# Altium schematic sheet Ornament.SchDoc
size C; SheetNumber: 1; SheetTotal: 1; ENG_APP_DATE: --/--/--; DSN_APP_DATE: --/--/--; CHK_APP_DATE: --/--/--; SchematicPartNumber: 1XPXXXX
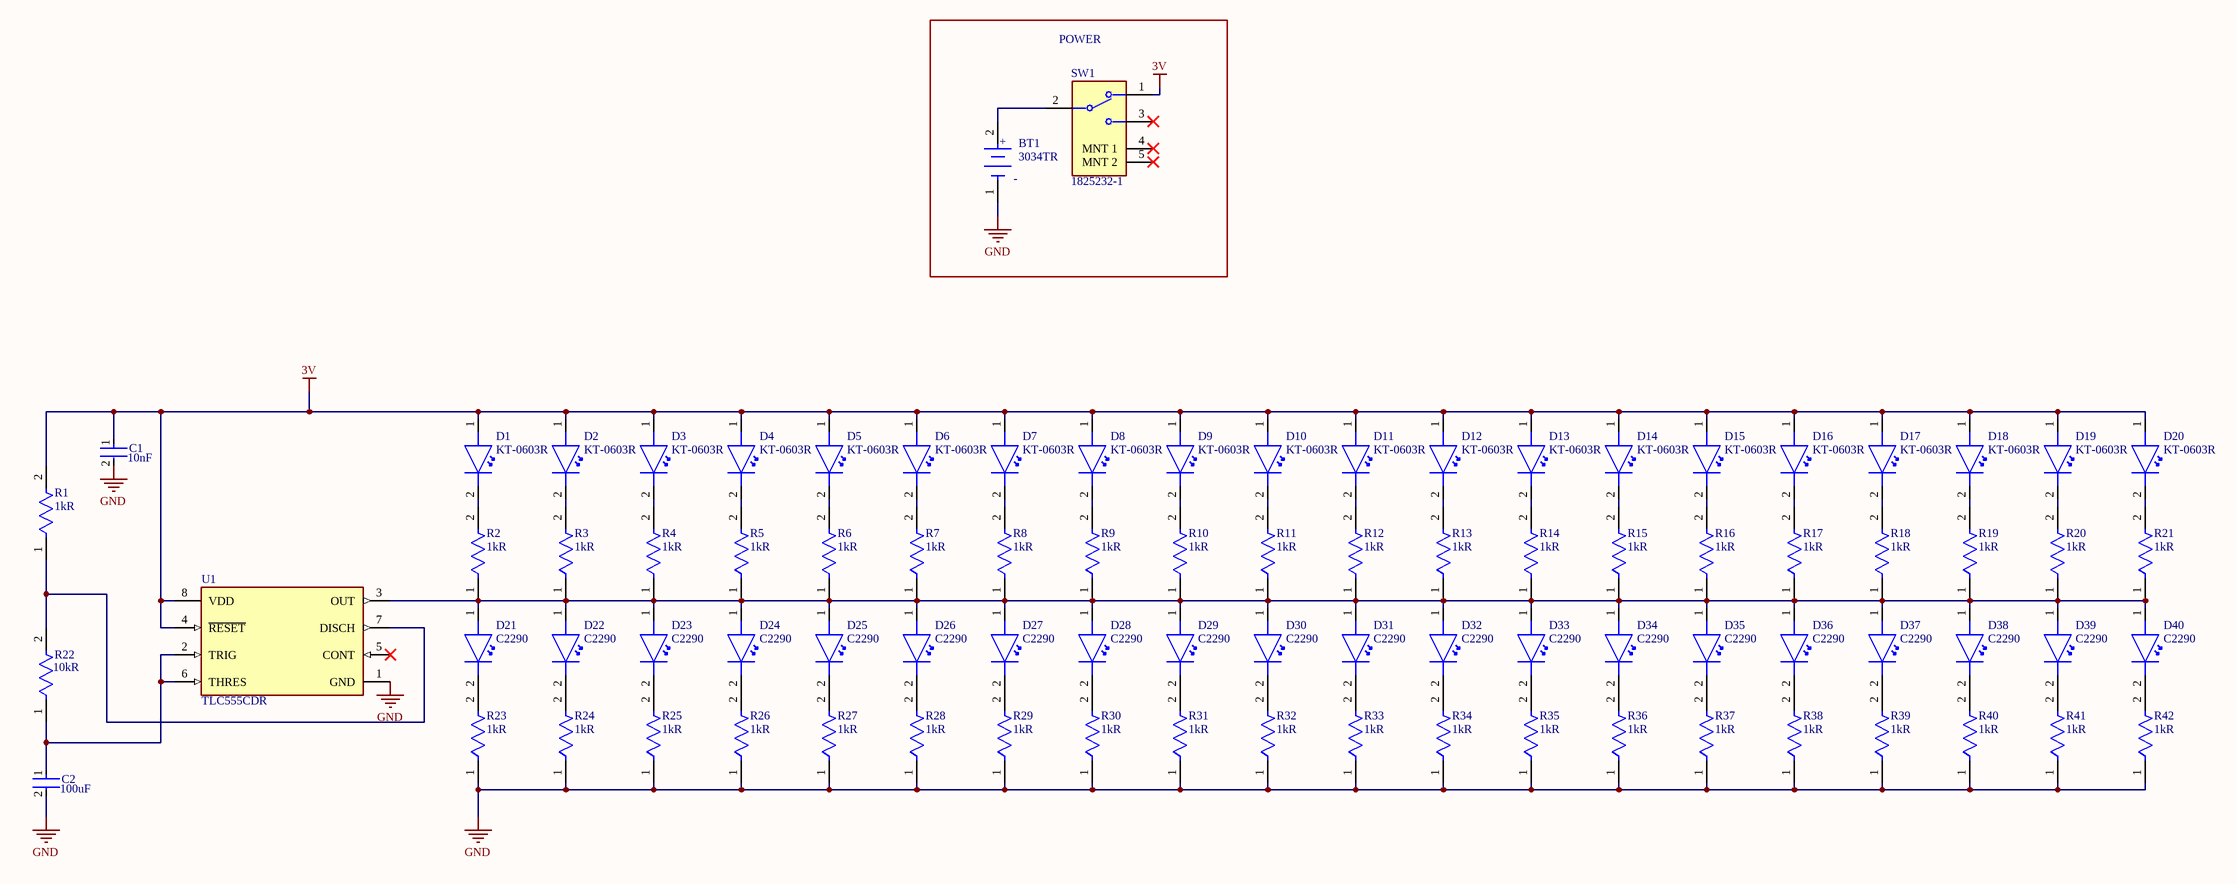
[diagram p0: Ornament.SchDoc]

## Parts
BT1  3034TR  [FP-3034TR-MFG]
C1  Capacitance: 10nF  [FP-CL165-IPC_C]  (hidden comment: CL05B103KB5NNNC)
C2  Capacitance: 100uF  [FP-MK316L-MFG]  (hidden comment: JMK316BJ107ML-T)
D1  KT-0603R  [LED_0603]
D2  KT-0603R  [LED_0603]
D3  KT-0603R  [LED_0603]
D4  KT-0603R  [LED_0603]
D5  KT-0603R  [LED_0603]
D6  KT-0603R  [LED_0603]
D7  KT-0603R  [LED_0603]
D8  KT-0603R  [LED_0603]
D9  KT-0603R  [LED_0603]
D10  KT-0603R  [LED_0603]
D11  KT-0603R  [LED_0603]
D12  KT-0603R  [LED_0603]
D13  KT-0603R  [LED_0603]
D14  KT-0603R  [LED_0603]
D15  KT-0603R  [LED_0603]
D16  KT-0603R  [LED_0603]
D17  KT-0603R  [LED_0603]
D18  KT-0603R  [LED_0603]
D19  KT-0603R  [LED_0603]
D20  KT-0603R  [LED_0603]
D21  C2290  [LED_0603]
D22  C2290  [LED_0603]
D23  C2290  [LED_0603]
D24  C2290  [LED_0603]
D25  C2290  [LED_0603]
D26  C2290  [LED_0603]
D27  C2290  [LED_0603]
D28  C2290  [LED_0603]
D29  C2290  [LED_0603]
D30  C2290  [LED_0603]
D31  C2290  [LED_0603]
D32  C2290  [LED_0603]
D33  C2290  [LED_0603]
D34  C2290  [LED_0603]
D35  C2290  [LED_0603]
D36  C2290  [LED_0603]
D37  C2290  [LED_0603]
D38  C2290  [LED_0603]
D39  C2290  [LED_0603]
D40  C2290  [LED_0603]
R1  Resistance: 1kR  [FP-AC0402-IPC_C]  (hidden comment: AC0402FR-071KL)
R2  Resistance: 1kR  [FP-AC0402-IPC_C]  (hidden comment: AC0402FR-071KL)
R3  Resistance: 1kR  [FP-AC0402-IPC_C]  (hidden comment: AC0402FR-071KL)
R4  Resistance: 1kR  [FP-AC0402-IPC_C]  (hidden comment: AC0402FR-071KL)
R5  Resistance: 1kR  [FP-AC0402-IPC_C]  (hidden comment: AC0402FR-071KL)
R6  Resistance: 1kR  [FP-AC0402-IPC_C]  (hidden comment: AC0402FR-071KL)
R7  Resistance: 1kR  [FP-AC0402-IPC_C]  (hidden comment: AC0402FR-071KL)
R8  Resistance: 1kR  [FP-AC0402-IPC_C]  (hidden comment: AC0402FR-071KL)
R9  Resistance: 1kR  [FP-AC0402-IPC_C]  (hidden comment: AC0402FR-071KL)
R10  Resistance: 1kR  [FP-AC0402-IPC_C]  (hidden comment: AC0402FR-071KL)
R11  Resistance: 1kR  [FP-AC0402-IPC_C]  (hidden comment: AC0402FR-071KL)
R12  Resistance: 1kR  [FP-AC0402-IPC_C]  (hidden comment: AC0402FR-071KL)
R13  Resistance: 1kR  [FP-AC0402-IPC_C]  (hidden comment: AC0402FR-071KL)
R14  Resistance: 1kR  [FP-AC0402-IPC_C]  (hidden comment: AC0402FR-071KL)
R15  Resistance: 1kR  [FP-AC0402-IPC_C]  (hidden comment: AC0402FR-071KL)
R16  Resistance: 1kR  [FP-AC0402-IPC_C]  (hidden comment: AC0402FR-071KL)
R17  Resistance: 1kR  [FP-AC0402-IPC_C]  (hidden comment: AC0402FR-071KL)
R18  Resistance: 1kR  [FP-AC0402-IPC_C]  (hidden comment: AC0402FR-071KL)
R19  Resistance: 1kR  [FP-AC0402-IPC_C]  (hidden comment: AC0402FR-071KL)
R20  Resistance: 1kR  [FP-AC0402-IPC_C]  (hidden comment: AC0402FR-071KL)
R21  Resistance: 1kR  [FP-AC0402-IPC_C]  (hidden comment: AC0402FR-071KL)
R22  Resistance: 10kR  [FP-AC0402-MFG]  (hidden comment: AC0402FR-0710KL)
R23  Resistance: 1kR  [FP-AC0402-IPC_C]  (hidden comment: AC0402FR-071KL)
R24  Resistance: 1kR  [FP-AC0402-IPC_C]  (hidden comment: AC0402FR-071KL)
R25  Resistance: 1kR  [FP-AC0402-IPC_C]  (hidden comment: AC0402FR-071KL)
R26  Resistance: 1kR  [FP-AC0402-IPC_C]  (hidden comment: AC0402FR-071KL)
R27  Resistance: 1kR  [FP-AC0402-IPC_C]  (hidden comment: AC0402FR-071KL)
R28  Resistance: 1kR  [FP-AC0402-IPC_C]  (hidden comment: AC0402FR-071KL)
R29  Resistance: 1kR  [FP-AC0402-IPC_C]  (hidden comment: AC0402FR-071KL)
R30  Resistance: 1kR  [FP-AC0402-IPC_C]  (hidden comment: AC0402FR-071KL)
R31  Resistance: 1kR  [FP-AC0402-IPC_C]  (hidden comment: AC0402FR-071KL)
R32  Resistance: 1kR  [FP-AC0402-IPC_C]  (hidden comment: AC0402FR-071KL)
R33  Resistance: 1kR  [FP-AC0402-IPC_C]  (hidden comment: AC0402FR-071KL)
R34  Resistance: 1kR  [FP-AC0402-IPC_C]  (hidden comment: AC0402FR-071KL)
R35  Resistance: 1kR  [FP-AC0402-IPC_C]  (hidden comment: AC0402FR-071KL)
R36  Resistance: 1kR  [FP-AC0402-IPC_C]  (hidden comment: AC0402FR-071KL)
R37  Resistance: 1kR  [FP-AC0402-IPC_C]  (hidden comment: AC0402FR-071KL)
R38  Resistance: 1kR  [FP-AC0402-IPC_C]  (hidden comment: AC0402FR-071KL)
R39  Resistance: 1kR  [FP-AC0402-IPC_C]  (hidden comment: AC0402FR-071KL)
R40  Resistance: 1kR  [FP-AC0402-IPC_C]  (hidden comment: AC0402FR-071KL)
R41  Resistance: 1kR  [FP-AC0402-IPC_C]  (hidden comment: AC0402FR-071KL)
R42  Resistance: 1kR  [FP-AC0402-IPC_C]  (hidden comment: AC0402FR-071KL)
SW1  1825232-1  [FP-1825232-1-MFG]
U1  TLC555CDR  [FP-D0008A-IPC_B]

## Blocks framed on the sheet
POWER: BT1 SW1

## Nets
3V: C1.1 D1.1 D2.1 D3.1 D4.1 D5.1 D6.1 D7.1 D8.1 D9.1 D10.1 D11.1 D12.1 D13.1 D14.1 D15.1 D16.1 D17.1 D18.1 D19.1 D20.1 R1.2 SW1.1 U1.4(~{RESET}) U1.8(VDD)
GND: BT1.1(C) C1.2 C2.2 R23.1 R24.1 R25.1 R26.1 R27.1 R28.1 R29.1 R30.1 R31.1 R32.1 R33.1 R34.1 R35.1 R36.1 R37.1 R38.1 R39.1 R40.1 R41.1 R42.1 U1.1(GND)
NetBT1_2: BT1.2(A) SW1.2
NetC2_1: C2.1 R22.1 U1.2(TRIG) U1.6(THRES)
NetD1_2: D1.2 R2.2
NetD2_2: D2.2 R3.2
NetD3_2: D3.2 R4.2
NetD4_2: D4.2 R5.2
NetD5_2: D5.2 R6.2
NetD6_2: D6.2 R7.2
NetD7_2: D7.2 R8.2
NetD8_2: D8.2 R9.2
NetD9_2: D9.2 R10.2
NetD10_2: D10.2 R11.2
NetD11_2: D11.2 R12.2
NetD12_2: D12.2 R13.2
NetD13_2: D13.2 R14.2
NetD14_2: D14.2 R15.2
NetD15_2: D15.2 R16.2
NetD16_2: D16.2 R17.2
NetD17_2: D17.2 R18.2
NetD18_2: D18.2 R19.2
NetD19_2: D19.2 R20.2
NetD20_2: D20.2 R21.2
NetD21_1: D21.1 D22.1 D23.1 D24.1 D25.1 D26.1 D27.1 D28.1 D29.1 D30.1 D31.1 D32.1 D33.1 D34.1 D35.1 D36.1 D37.1 D38.1 D39.1 D40.1 R2.1 R3.1 R4.1 R5.1 R6.1 R7.1 R8.1 R9.1 R10.1 R11.1 R12.1 R13.1 R14.1 R15.1 R16.1 R17.1 R18.1 R19.1 R20.1 R21.1 U1.3(OUT)
NetD21_2: D21.2 R23.2
NetD22_2: D22.2 R24.2
NetD23_2: D23.2 R25.2
NetD24_2: D24.2 R26.2
NetD25_2: D25.2 R27.2
NetD26_2: D26.2 R28.2
NetD27_2: D27.2 R29.2
NetD28_2: D28.2 R30.2
NetD29_2: D29.2 R31.2
NetD30_2: D30.2 R32.2
NetD31_2: D31.2 R33.2
NetD32_2: D32.2 R34.2
NetD33_2: D33.2 R35.2
NetD34_2: D34.2 R36.2
NetD35_2: D35.2 R37.2
NetD36_2: D36.2 R38.2
NetD37_2: D37.2 R39.2
NetD38_2: D38.2 R40.2
NetD39_2: D39.2 R41.2
NetD40_2: D40.2 R42.2
NetR1_1: R1.1 R22.2 U1.7(DISCH)

Not connected (* = marked no-connect by the designer): SW1 3* 4(MNT_1)* 5(MNT_2)*; U1 5(CONT)*

## Notes on the sheet
- CONFIDENTIAL
- DWG. NO.
- This drawing, including the information it bears, is the property of Fisher-Rosemount Systems Inc. (FRSI) and must be held in strict confidence and properly safeguarded by the recipient at all times. it may not be copied or reproduced, or provided or revealed to any other party, except with the prior written authorization of FRSI and
- any authorized copy or reproduction must inlcude this legend. The recipient may use the same only for the purpose for which FRSI has provided it to recipient, and it must be returned to FRSI, along with all ocpies and reproductions, upon request. By accpeting this drawing, the recipient agrees to the foregoing.
- TOLERANCES
- UNLESS OTHERWISE SPECIFIED
- .X
- .XX
- .XXX
- _
- c
- ALL RIGHTS RESERVED
- FISHER-ROSEMOUNT SYSTEMS INC.
- SCHEMATIC
- UNIT OF MEASURE
- R OR CHAM MAX
- REVISIONS
- DWN.
- CHKD.
- BY
- DATE
- DESIGN
- DWG NO.
- REV.
- DO NOT SCALE THIS DWG
- ANSI Y14.5
- SUPERSEDES
- Fisher-Rosemount Systems
- Round Rock,Texas, USA
- APVD.
- SCALE
- 1=1
- TOOL
- M
- SIZE
- C
- SHEET
- OF
- (in symbol CMP-19636-000007-1) +; -

## Library data of the parts
BT1 = CMP-19636-000007-1: BATTERY RETAINER COIN 20MM SMD; Number of Batteries: 1; Lead Free: Lead Free; Mount: Surface Mount; Number of Cells: 1; Termination: SMD/SMT; Package Quantity: 500; Packaging: Tape and Reel; Contact Plating: Tin; Case/Package: SMD/SMT; Material: Bronze
C1 = CMP-13271-000387-1: Cap Ceramic 10nF 50V X7R ±10% SMD 0402 +125°C Paper T/R; Depth: 0.5mm; Length: 1mm; Lead Free: Lead Free; Case Code (Metric): 1005; Width: 0.02inch; Min Operating Temperature: -55°C; Thickness: 0.022inch; Package Quantity: 1; Mount: Surface Mount; Height: 0.5mm; Voltage: 50V; Material: Ceramic; Tolerance: 10%; Case Code (Imperial): 0402; Radiation Hardening: No; Case/Package: 0402; Max Operating Temperature: 125°C; Voltage Rating (DC): 50V; Contact Plating: Tin; Packaging: Tape and Reel; Voltage Rating: 50V; Dielectric: X7R
C2 = CMP-2000-06499-2: CAP CER 100UF 6.3V X5R 1206; Tolerance: 2%; Depth: 1.6mm; Voltage Rating (DC): 6.3V; RoHS Compliant: Yes; Case Code (Metric): 3216; Thickness: 0.071inch; Package Quantity: 1; Max Operating Temperature: 85°C; Series: M; Mount: Surface Mount; Radiation Hardening: No; Termination: SMD/SMT; Voltage Rating: 6.3V; Width: 0.063inch; Packaging: Tape and Reel; Number of Pins: 2; Case/Package: 1206; Construction: Flat; Length: 3.2mm; Dielectric: X5R; Min Operating Temperature: -55°C; Height: 1.6mm; Case Code (Imperial): 1206; Lead Free: Lead Free
D1-D20 = KT-0603R: Red 615~630nm 1.9~2.2V 0603 Light Emitting Diodes (LED) RoHS
D21-D40 = C2290: White 0603 Light Emitting Diodes (LED) RoHS
R1-R21 R23-R42 = CMP-2002-01799-3: RES 1kΩ ±1% 0.063W 0402; Temperature Coefficient: 100ppm/°C; Power Rating: 62.5mW; Max Power Dissipation: 63mW; Voltage Rating: 50V; Height: 0.015inch; Size Code: 0402; Min Operating Temperature: -55°C; Number of Terminations: 2; Width: 0.02inch; RoHS Compliant: Yes; Termination: SMD/SMT; Construction: Rectangular; Tolerance: 1%; Military Standard: Not; Series: AC; Packaging: Tape and Reel; Depth: 0.5mm; Lead Free: Lead Free; Max Operating Temperature: 155°C; Case Code (Metric): 1005; Resistor Type: Thick Film; Features: Moisture Resistant; Case Code (Imperial): 0402; Package Quantity: 1; Case/Package: 0402; Length: 0.039inch
R22 = CMP-2002-01790-3: RES 10kΩ ±1% 0.063W 0402; Power Rating: 62.5mW; Voltage Rating: 50V; Temperature Coefficient: 100ppm/°C; Max Power Dissipation: 63mW; Tolerance: 1%; Military Standard: Not; Construction: Rectangular; Termination: SMD/SMT; Max Operating Temperature: 155°C; Min Operating Temperature: -55°C; Height: 0.015inch; Lead Free: Lead Free; Width: 0.02inch; Case/Package: 0402; Resistor Type: Thick Film; Series: AC; Features: Moisture Resistant; RoHS Compliant: Yes; Number of Terminations: 2; Case Code (Metric): 1005; Length: 0.039inch; Depth: 0.5mm; Size Code: 0402; Packaging: Tape and Reel; Case Code (Imperial): 0402
SW1 = CMP-03405-000001-1: SWITCH SLIDE SPDT 200MA 30V; Manufacturer: TE Connectivity; Contact Current Rating: 0.2A; Description: Switch Slide ON None ON SPDT Side Slide 0.2A 30VDC 10000Cycle PC Pins Bracket Mount/Through Hole; Contact Resistance: 20mΩ; Electromechanical Life: 10000Cycles; Operating Force: 200gf; Throw Configuration: SPDT; Manufacturer Part Number: 1825232-1; Temperature Range High: +70°C; Height: 3.7mm; ComponentLink2URL: https://www.te.com/commerce/DocumentDelivery/DDEController?Action=showdoc&DocId=Customer+Drawing%7F1825232%7FB2%7Fpdf%7FEnglish%7FENG_CD_1825232_B2.pdf%7F1825232-1; Mount: Through Hole; Mouser Description: Slide Switches SLIDE SWITCH SPDT Right Angle; Package: 1825232-1; Temperature: -20°C to +70°C; Automotive: No; ComponentLink2Description: Datasheet; Lead Free: Yes; Octopart: https://octopart.com/1825232-1-te+connectivity-45209882; Device Class L1: Electromechanical; Digikey Description: SWITCH SLIDE SPDT 200MA 30V; Device Class L3: Slide Switches; Device Class L2: Switches; Voltage Rating Dc: 30V; Temperature Range Low: -20°C; Category: Switch; RoHS: TRUE
U1 = CMP-04857-000001-1: IC OSC SGL TIMER 2.1MHZ 8-SOIC; Min Supply Voltage: 2V; Number of Channels: 1; Max Power Dissipation: 725mW; Max Supply Voltage: 15V; Low Level Output Current: 100mA; Current Rating: 250A; Quiescent Current: 250uA; Operating Supply Current: 360uA; High Level Output Current: -10mA; Width: 3.91mm; Case/Package: SOIC; Weight: 0.002561oz; Frequency: 2.1MHz; Height: 1.58mm; Package Quantity: 2500; REACH SVHC: No SVHC; Number of Timers/Counters: 1; Lead Free: Lead Free; Number of Pins: 8; Max Operating Temperature: 125°C; Min Operating Temperature: -40°C; Length: 4.9mm; Radiation Hardening: No; Packaging: Tape and Reel; Termination: SMD/SMT; Mount: Surface Mount; Power Dissipation: 725mW